# Altium project ADS1256.PrjPcb
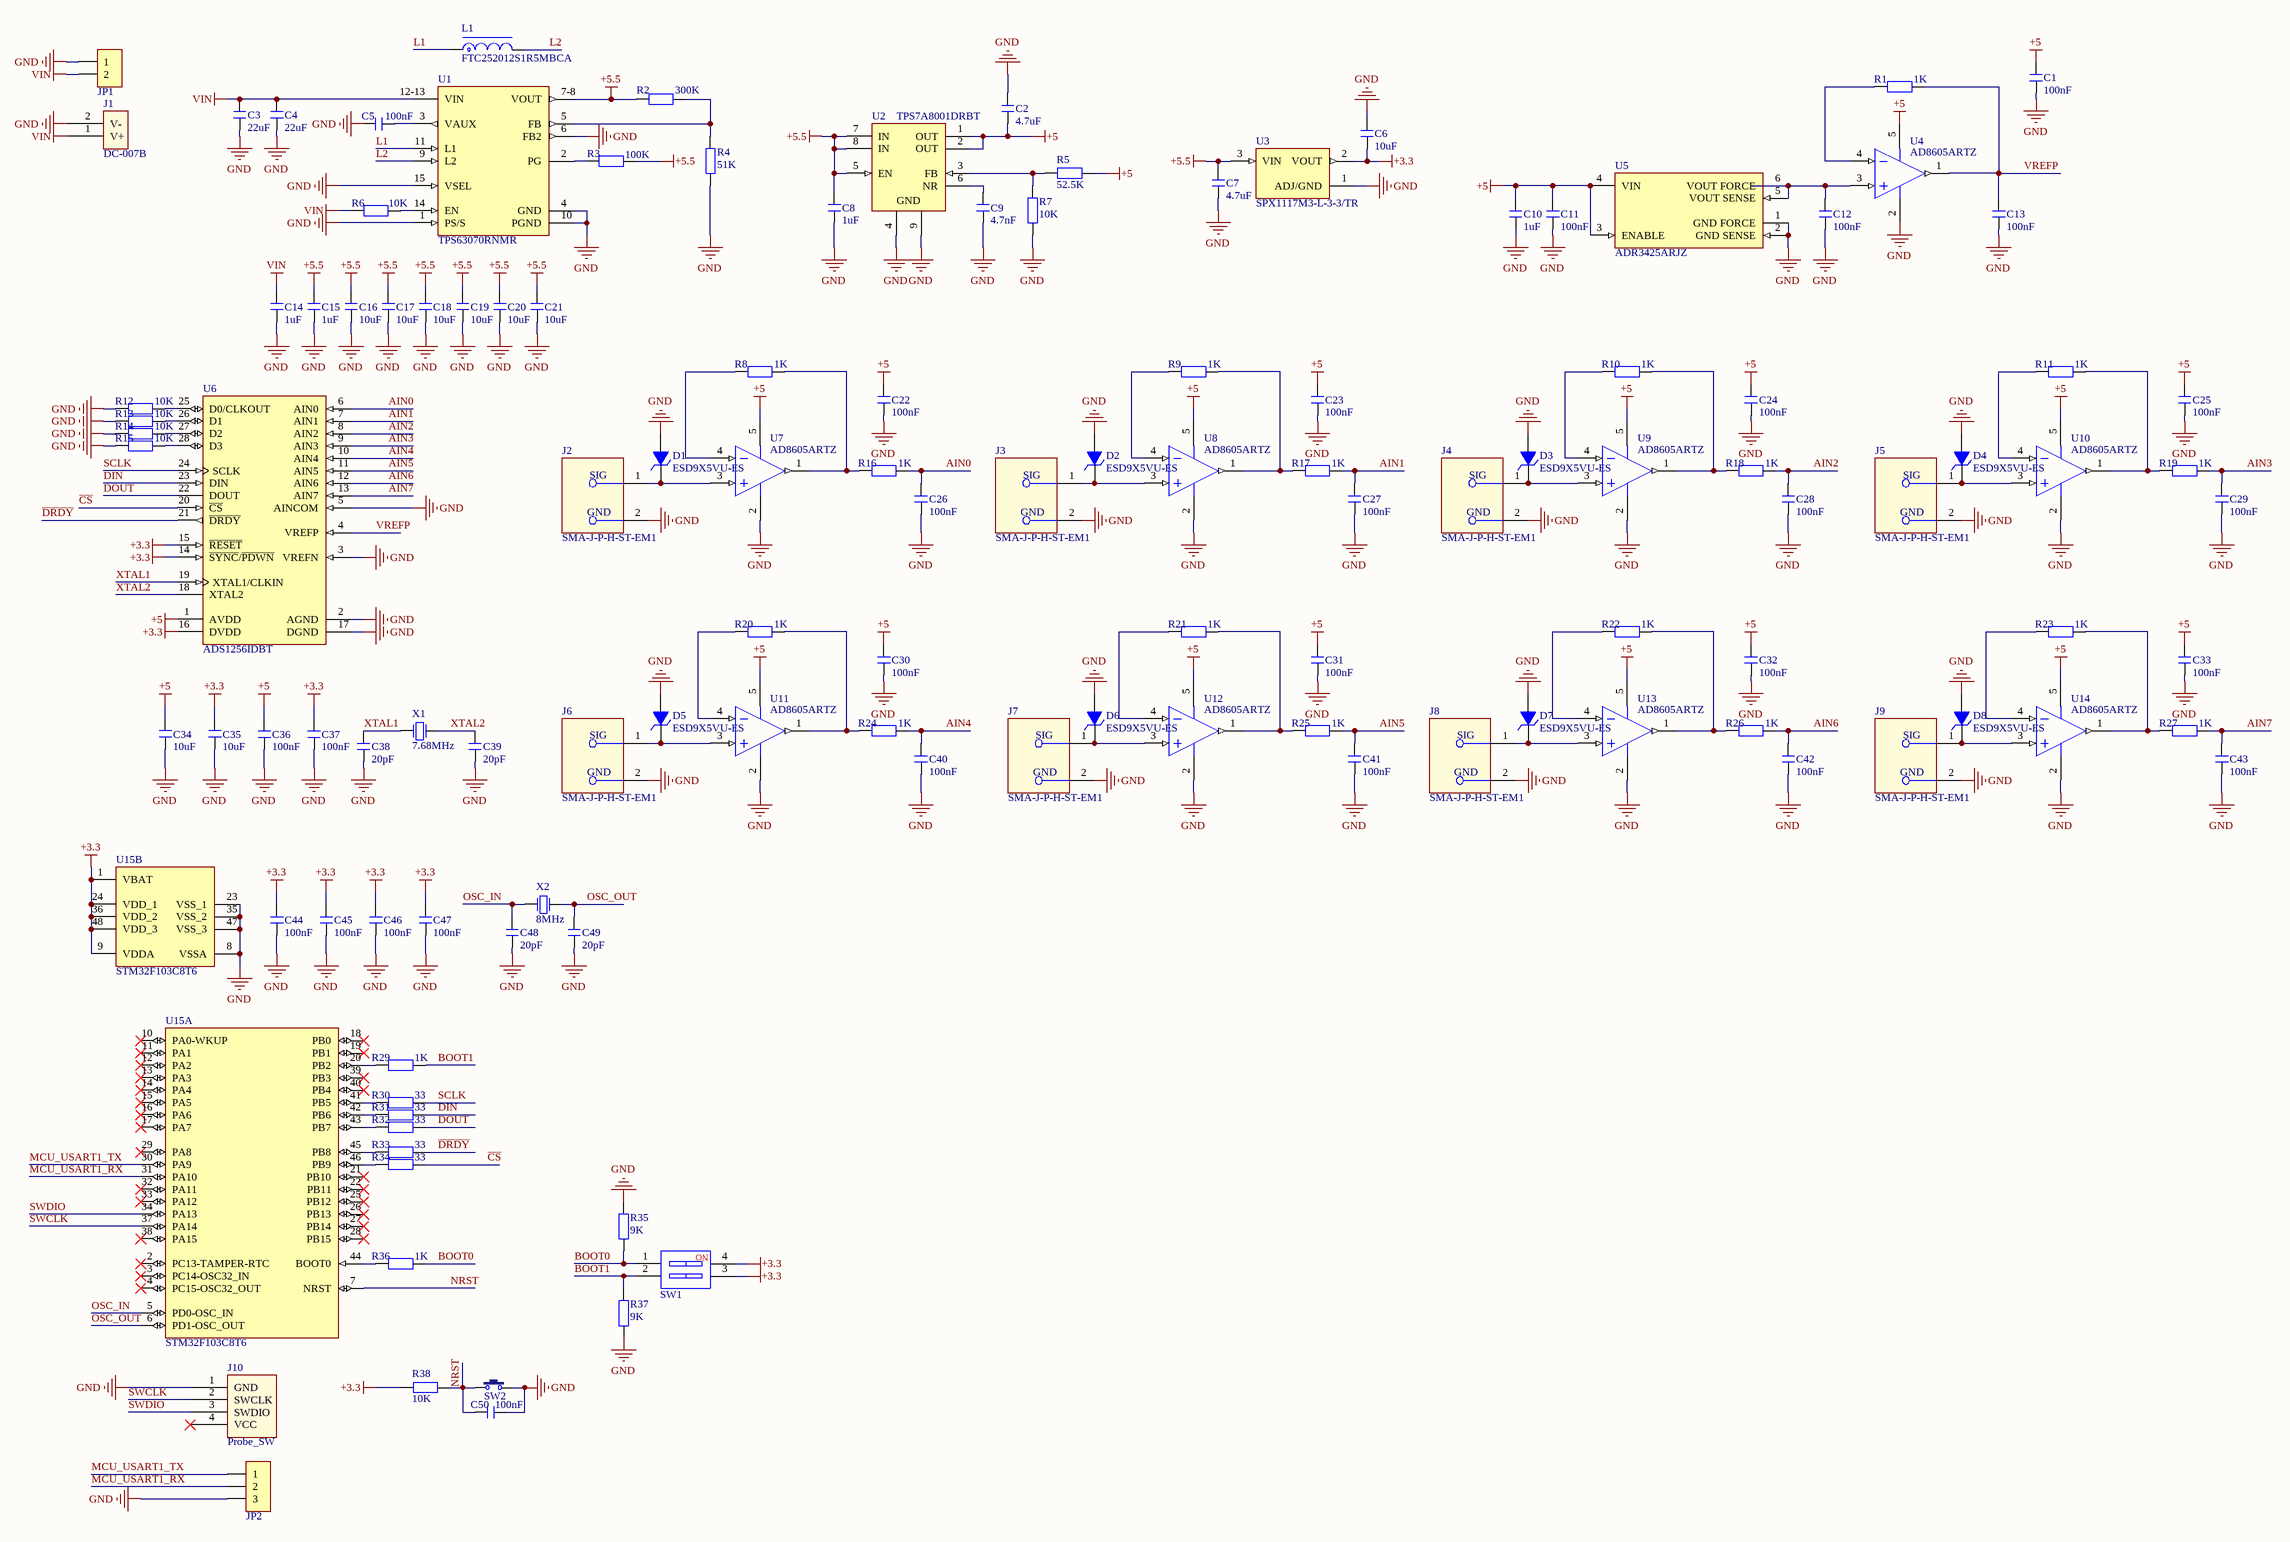
[diagram p0: ADS1256.SchDoc]
1 sheet, 127 parts. Net scope: global (net labels, ports and power ports of the same name join across sheets).
Board file: ADS1256.PcbDoc

## Sheet ADS1256.SchDoc
size A2; SheetNumber: 1; SheetTotal: 1

### Parts
C1  100nF  [C 0402_L]
C2  4.7uF  [C 0603_L]
C3  22uF  [C 1206_L]
C4  22uF  [C 1206_L]
C5  100nF  [C 0402_L]
C6  10uF  [C 0805_L]
C7  4.7uF  [C 0603_L]
C8  1uF  [C 0402_L]
C9  4.7nF  [C 0402_L]
C10  1uF  [C 0603_L]
C11  100nF  [C 0402_L]
C12  100nF  [C 0402_L]
C13  100nF  [C 0402_L]
C14  1uF  [C 0402_L]
C15  1uF  [C 0402_L]
C16  10uF  [C 0805_L]
C17  10uF  [C 0805_L]
C18  10uF  [C 0805_L]
C19  10uF  [C 0805_L]
C20  10uF  [C 0805_L]
C21  10uF  [C 0805_L]
C22  100nF  [C 0402_L]
C23  100nF  [C 0402_L]
C24  100nF  [C 0402_L]
C25  100nF  [C 0402_L]
C26  100nF  [C 0402_L]
C27  100nF  [C 0402_L]
C28  100nF  [C 0402_L]
C29  100nF  [C 0402_L]
C30  100nF  [C 0402_L]
C31  100nF  [C 0402_L]
C32  100nF  [C 0402_L]
C33  100nF  [C 0402_L]
C34  10uF  [C 0805_L]
C35  10uF  [C 0805_L]
C36  100nF  [C 0402_L]
C37  100nF  [C 0402_L]
C38  20pF  [C 0402_L]
C39  20pF  [C 0402_L]
C40  100nF  [C 0402_L]
C41  100nF  [C 0402_L]
C42  100nF  [C 0402_L]
C43  100nF  [C 0402_L]
C44  100nF  [C 0402_L]
C45  100nF  [C 0402_L]
C46  100nF  [C 0402_L]
C47  100nF  [C 0402_L]
C48  20pF  [C 0402_L]
C49  20pF  [C 0402_L]
C50  100nF  [C 0402_L]
D1  ESD9X5VU-ES  [DFN1006-2]
D2  ESD9X5VU-ES  [DFN1006-2]
D3  ESD9X5VU-ES  [DFN1006-2]
D4  ESD9X5VU-ES  [DFN1006-2]
D5  ESD9X5VU-ES  [DFN1006-2]
D6  ESD9X5VU-ES  [DFN1006-2]
D7  ESD9X5VU-ES  [DFN1006-2]
D8  ESD9X5VU-ES  [DFN1006-2]
J1  DC-007B  [DC-007B]
J2  SMA-J-P-H-ST-EM1  [FP-SMA-J-P-H-ST-EM1-MFG]
J3  SMA-J-P-H-ST-EM1  [FP-SMA-J-P-H-ST-EM1-MFG]
J4  SMA-J-P-H-ST-EM1  [FP-SMA-J-P-H-ST-EM1-MFG]
J5  SMA-J-P-H-ST-EM1  [FP-SMA-J-P-H-ST-EM1-MFG]
J6  SMA-J-P-H-ST-EM1  [FP-SMA-J-P-H-ST-EM1-MFG]
J7  SMA-J-P-H-ST-EM1  [FP-SMA-J-P-H-ST-EM1-MFG]
J8  SMA-J-P-H-ST-EM1  [FP-SMA-J-P-H-ST-EM1-MFG]
J9  SMA-J-P-H-ST-EM1  [FP-SMA-J-P-H-ST-EM1-MFG]
J10  Probe_SW  [Probe_SW]
JP1  HDR-1X2  [KF2510-LI-2P]  (value not drawn)
JP2  HDR-1X3  [HDR2.54-LI-3P]  (value not drawn)
L1  FTC252012S1R5MBCA  [NR2520]
R1  1K  [R 0402_L]
R2  300K  [R 0402_L]
R3  100K  [R 0402_L]
R4  51K  [R 0402_L]
R5  52.5K  [R 0402_L]
R6  10K  [R 0402_L]
R7  10K  [R 0402_L]
R8  1K  [R 0402_L]
R9  1K  [R 0402_L]
R10  1K  [R 0402_L]
R11  1K  [R 0402_L]
R12  10K  [R 0402_L]
R13  10K  [R 0402_L]
R14  10K  [R 0402_L]
R15  10K  [R 0402_L]
R16  1K  [R 0402_L]
R17  1K  [R 0402_L]
R18  1K  [R 0402_L]
R19  1K  [R 0402_L]
R20  1K  [R 0402_L]
R21  1K  [R 0402_L]
R22  1K  [R 0402_L]
R23  1K  [R 0402_L]
R24  1K  [R 0402_L]
R25  1K  [R 0402_L]
R26  1K  [R 0402_L]
R27  1K  [R 0402_L]
R29  1K  [R 0402_L]
R30  33  [R 0402_L]
R31  33  [R 0402_L]
R32  33  [R 0402_L]
R33  33  [R 0402_L]
R34  33  [R 0402_L]
R35  9K  [R 0402_L]
R36  1K  [R 0402_L]
R37  9K  [R 0402_L]
R38  10K  [R 0402_L]
SW1  SW-2P  [CSW1.27 SMD-2P]  (value not drawn)
SW2  3x6x5  [TSW SMD-3*6*2.5]  (value not drawn)
U1  TPS63070RNMR  [FP-RNM0015A-MFG]
U2  TPS7A8001DRBT  [DRB0008A_V]
U3  SPX1117M3-L-3-3/TR  [SOT230P700X180-3N]
U4  AD8605ARTZ  [SOT23-5]
U5  ADR3425ARJZ  [SOT23-6L]
U6  ADS1256IDBT  [SSOP28]
U7  AD8605ARTZ  [SOT23-5]
U8  AD8605ARTZ  [SOT23-5]
U9  AD8605ARTZ  [SOT23-5]
U10  AD8605ARTZ  [SOT23-5]
U11  AD8605ARTZ  [SOT23-5]
U12  AD8605ARTZ  [SOT23-5]
U13  AD8605ARTZ  [SOT23-5]
U14  AD8605ARTZ  [SOT23-5]
U15  STM32F103C8T6  [STM-LQFP48_L]  (parts A,B of 2)
X1  7.68MHz  [OSC HC-49SMD]
X2  8MHz  [OSC 5032-2P]

### Nets
+3.3: C6.1 C35.1 C37.2 C44.2 C45.2 C46.2 C47.2 R38.2 SW1.3 SW1.4 U3.2(VOUT) U6.14(~{SYNC}/~{PDWN}) U6.15(~{RESET}) U6.16(DVDD) U15.1(VBAT) U15.9(VDDA) U15.24(VDD_1) U15.36(VDD_2) U15.48(VDD_3)
+5: C1.2 C2.1 C10.2 C11.2 C22.2 C23.2 C24.2 C25.2 C30.2 C31.2 C32.2 C33.2 C34.1 C36.2 R5.1 U2.1(OUT) U2.2(OUT) U4.5(+V) U5.3(ENABLE) U5.4(VIN) U6.1(AVDD) U7.5(+V) U8.5(+V) U9.5(+V) U10.5(+V) U11.5(+V) U12.5(+V) U13.5(+V) U14.5(+V)
+5.5: C7.2 C8.2 C15.1 C16.1 C17.1 C18.1 C19.1 C20.1 C21.1 R2.2 R3.1 U1.7-8(VOUT) U2.5(EN) U2.7(IN) U2.8(IN) U3.3(VIN)
GND: C1.1 C2.2 C3.1 C4.1 C5.2 C6.2 C7.1 C8.1 C9.1 C10.1 C11.1 C12.1 C13.1 C14.2 C15.2 C16.2 C17.2 C18.2 C19.2 C20.2 C21.2 C22.1 C23.1 C24.1 C25.1 C26.1 C27.1 C28.1 C29.1 C30.1 C31.1 C32.1 C33.1 C34.2 C35.2 C36.1 C37.1 C38.1 C39.1 C40.1 C41.1 C42.1 C43.1 C44.1 C45.1 C46.1 C47.1 C48.1 C49.1 C50.2 D1.2(A) D2.2(A) D3.2(A) D4.2(A) D5.2(A) D6.2(A) D7.2(A) D8.2(A) J1.2(V-) J2.2(MNT_1) J3.2(MNT_1) J4.2(MNT_1) J5.2(MNT_1) J6.2(MNT_1) J7.2(MNT_1) J8.2(MNT_1) J9.2(MNT_1) J10.1(GND) JP1.1 JP2.3 R4.1 R7.1 R12.2 R13.2 R14.2 R15.2 R35.2 R37.1 SW2.2 U1.1(PS/S) U1.4(GND) U1.6(FB2) U1.10(PGND) U1.15(VSEL) U2.4(GND) U2.9(GND) U3.1(ADJ/GND) U4.2(-V) U5.1(GND_FORCE) U5.2(GND_SENSE) U6.2(AGND) U6.3(VREFN) U6.5(AINCOM) U6.17(DGND) U7.2(-V) U8.2(-V) U9.2(-V) U10.2(-V) U11.2(-V) U12.2(-V) U13.2(-V) U14.2(-V) U15.8(VSSA) U15.23(VSS_1) U15.35(VSS_2) U15.47(VSS_3)
VIN: C3.2 C4.2 C14.1 J1.1(V+) JP1.2 R6.1 U1.12-13(VIN)
AIN0: C26.2 R16.2 U6.6(AIN0)
AIN1: C27.2 R17.2 U6.7(AIN1)
AIN2: C28.2 R18.2 U6.8(AIN2)
AIN3: C29.2 R19.2 U6.9(AIN3)
AIN4: C40.2 R24.2 U6.10(AIN4)
AIN5: C41.2 R25.2 U6.11(AIN5)
AIN6: C42.2 R26.2 U6.12(AIN6)
AIN7: C43.2 R27.2 U6.13(AIN7)
BOOT0: R35.1 R36.2 SW1.1
BOOT1: R29.2 R37.2 SW1.2
~{CS}: R34.2 U6.20(~{CS})
~{DRDY}: R33.2 U6.21(~{DRDY})
DIN: R31.2 U6.23(DIN)
DOUT: R32.2 U6.22(DOUT)
L1: L1.1 U1.11(L1)
L2: L1.2 U1.9(L2)
MCU_USART1_RX: JP2.2 U15.31(PA10)
MCU_USART1_TX: JP2.1 U15.30(PA9)
NRST: C50.1 R38.1 SW2.1 U15.7(NRST)
OSC_IN: C48.2 U15.5(PD0-OSC_IN) X2.1
OSC_OUT: C49.2 U15.6(PD1-OSC_OUT) X2.2
SCLK: R30.2 U6.24(SCLK)
SWCLK: J10.2(SWCLK) U15.37(PA14)
SWDIO: J10.3(SWDIO) U15.34(PA13)
VREFP: C13.2 R1.2 U4.1(OUT) U6.4(VREFP)
XTAL1: C38.2 U6.19(XTAL1/CLKIN) X1.1
XTAL2: C39.2 U6.18(XTAL2) X1.2
NetC5_1: C5.1 U1.3(VAUX)
NetC9_2: C9.2 U2.6(NR)
NetC12_2: C12.2 U4.3(+IN) U5.5(VOUT_SENSE) U5.6(VOUT_FORCE)
NetD1_1: D1.1(K) J2.1 U7.3(+IN)
NetD2_1: D2.1(K) J3.1 U8.3(+IN)
NetD3_1: D3.1(K) J4.1 U9.3(+IN)
NetD4_1: D4.1(K) J5.1 U10.3(+IN)
NetD5_1: D5.1(K) J6.1 U11.3(+IN)
NetD6_1: D6.1(K) J7.1 U12.3(+IN)
NetD7_1: D7.1(K) J8.1 U13.3(+IN)
NetD8_1: D8.1(K) J9.1 U14.3(+IN)
NetR1_1: R1.1 U4.4(-IN)
NetR2_1: R2.1 R4.2 U1.5(FB)
NetR3_2: R3.2 U1.2(PG)
NetR5_2: R5.2 R7.2 U2.3(FB)
NetR6_2: R6.2 U1.14(EN)
NetR8_1: R8.1 U7.4(-IN)
NetR8_2: R8.2 R16.1 U7.1(OUT)
NetR9_1: R9.1 U8.4(-IN)
NetR9_2: R9.2 R17.1 U8.1(OUT)
NetR10_1: R10.1 U9.4(-IN)
NetR10_2: R10.2 R18.1 U9.1(OUT)
NetR11_1: R11.1 U10.4(-IN)
NetR11_2: R11.2 R19.1 U10.1(OUT)
NetR12_1: R12.1 U6.25(D0/CLKOUT)
NetR13_1: R13.1 U6.26(D1)
NetR14_1: R14.1 U6.27(D2)
NetR15_1: R15.1 U6.28(D3)
NetR20_1: R20.1 U11.4(-IN)
NetR20_2: R20.2 R24.1 U11.1(OUT)
NetR21_1: R21.1 U12.4(-IN)
NetR21_2: R21.2 R25.1 U12.1(OUT)
NetR22_1: R22.1 U13.4(-IN)
NetR22_2: R22.2 R26.1 U13.1(OUT)
NetR23_1: R23.1 U14.4(-IN)
NetR23_2: R23.2 R27.1 U14.1(OUT)
NetR29_1: R29.1 U15.20(PB2)
NetR30_1: R30.1 U15.41(PB5)
NetR31_1: R31.1 U15.42(PB6)
NetR32_1: R32.1 U15.43(PB7)
NetR33_1: R33.1 U15.45(PB8)
NetR34_1: R34.1 U15.46(PB9)
NetR36_1: R36.1 U15.44(BOOT0)

Not connected (* = marked no-connect by the designer): J10 4(VCC)*; U15 2(PC13-TAMPER-RTC)* 3(PC14-OSC32_IN)* 4(PC15-OSC32_OUT)* 10(PA0-WKUP)* 11(PA1)* 12(PA2)* 13(PA3)* 14(PA4)* 15(PA5)* 16(PA6)* 17(PA7)* 18(PB0)* 19(PB1)* 21(PB10)* 22(PB11)* 25(PB12)* 26(PB13)* 27(PB14)* 28(PB15)* 29(PA8)* 32(PA11)* 33(PA12)* 38(PA15)* 39(PB3)* 40(PB4)*

### Notes on the sheet
- (in symbol CMP-02754-000006-1) SIG; GND
- (in symbol SW-2P) NO

### Library data of the parts
C1-C50 = C: 贴片电容; 淘宝ID: 小糖豆的小窝窝; BOM名称: 贴片电容; 下单链接: https://item.taobao.com/item.htm?ft=t&id=613637044352
D1-D8 = ESD: ESD保护
J2-J9 = CMP-02754-000006-1: CONN SMA JACK STR 50OHM EDGE MNT; Center Contact Plating: Gold; Voltage Rating: 335V; Impedance: 50R; Max Frequency: 6GHz; Body Material: Brass; Dielectric Material: PTFE; Connector Type: SMA; Series: SMA; Fastening Type: Threaded; Depth: 13.33mm; Max Operating Temperature: 125°C; Termination: Solder; Length: 6.35mm; Radiation Hardening: No; RoHS Compliant: Yes; Insulation Material: Polytetrafluoroethylene; Min Operating Temperature: -65°C; Packaging: Tray; Housing Color: Gold; Body Plating: Gold; Mount: Edge; Contact Material: Copper; Orientation: Straight; Package Quantity: 1; Contact Plating: Gold; Case/Package: SMA
JP1 = Header 2: 2P接插件; 淘宝ID: 小糖豆的小窝窝; BOM名称: 2P接插件; 下单链接: https://item.taobao.com/item.htm?ft=t&id=613637044352
JP2 = Header 3: 3P接插件; 淘宝ID: 小糖豆的小窝窝; BOM名称: 3P接插件; 下单链接: https://item.taobao.com/item.htm?ft=t&id=613637044352
L1 = L-CDRH: 功率屏蔽电感; 淘宝ID: 小糖豆的小窝窝; BOM名称: 功率屏蔽电感; 下单链接: https://item.taobao.com/item.htm?ft=t&id=613637044352
R1-R27 R29-R38 = R: 贴片电阻; 淘宝ID: 小糖豆的小窝窝; BOM名称: 贴片电阻; 下单链接: https://item.taobao.com/item.htm?ft=t&id=613637044352
SW1 = SW-2P: 2路编码开关; 淘宝ID: 小糖豆的小窝窝; BOM名称: 2路编码开关; 下单链接: https://item.taobao.com/item.htm?ft=t&id=613637044352
SW2 = TSW 3x6: 3x6轻触开关; 淘宝ID: 小糖豆的小窝窝; BOM名称: 3x6轻触开关; 下单链接: https://item.taobao.com/item.htm?ft=t&id=613637044352
U1 = CMP-04918-000409-1: IC REG BCK BST ADJ 3.6A 15VQFN; Min Output Voltage: 2.5V; Output Configuration: Positive; Min Input Voltage: 2V; Switching Frequency: 2.4MHz; Topology: Buck-Boost; Number of Outputs: 1; Max Output Voltage: 9V; Output Current: 2A; Synchronous Rectifier: Yes; Output Type: Adjustable; Max Input Voltage: 16V; Quiescent Current: 50uA; Max Operating Temperature: 125°C; Case/Package: VQFN; Min Operating Temperature: -40°C; Packaging: Tape and Reel; RoHS Compliant: Yes; Number of Pins: 15; Mount: Surface Mount; Lead Free: Lead Free
U2 = CMP-0395-00597-2: Single Output LDO, 1 A, Adjustable 0.8 to 6 V Output, 2.2 to 6.5 V Input, with High-Bandwidth PSRR, 8-pin SON (DRB), -40 to 125 degC, Green (RoHS & no Sb/Br); Manufacturer: Texas Instruments; Vin(Min)(V): 2.2; Iq(Typ)(mA): 0.04; Vout Adj(Max)(V): 6; SubFamily: Single Channel LDO; Accuracy(%): 3; Vin(Max)(V): 6.5; Vdo(Typ)(mV): 170; Vout Adj(Min)(V): 0.8; Iout(Max)(A): 1; PackageReference: DRB0008A; ComponentLink3URL: http://www.ti.com/litv/pdf/mpds118h; Eco-Plan: Green (RoHS & no Sb/Br); ComponentLink2Description: Datasheet; PackageVersion: 4203482-2/K; PackageDescription: 8-Pin Plastic Small Outline, Body 3 x 3 mm, Pitch 0.65 mm; ComponentLink2URL: http://www.ti.com/general/docs/lit/getliterature.tsp?genericPartNumber=TPS7A8001&fileType=pdf; ComponentLink1Description: Manufacturer URL; DatasheetVersion: SBVS135G; ComponentLink1URL: http://www.ti.com/; Mounting Technology: Surface Mount; PartNumber: TPS7A8001DRBT; ComponentLink3Description: Package Specification
U3 = SPX1117M3-L-3-3/TR: Linear Voltage Regulator IC Positive Fixed 1 Output 800mA SOT-223; MF: MaxLinear, Inc.; Value: *; SnapEDA_Link: https://www.snapeda.com/parts/SPX1117M3-L-3-3/TR/MaxLinear%2C%20Inc./view-part/376705/?ref=snap; Package: SOT-223 Exar; MP: SPX1117M3-L-3-3/TR; Price: None; Availability: Unavailable
U4 U7-U14 = AD8605ARTZ: Precision Low Noise CMOS Rail-to-Rail Input/Output Operational Amplifiers
U5 = ADR3425ARJZ: Micropower, High Accuracy / Voltage References, 2.5V; Reference Type: Series; Temperature Coefficient: 8ppm/°C; Supply Current: 85uA; Output Current: 10mA; Min Input Voltage: 2.7V; Number of Channels: 1; Tolerance: 0.1%; Max Input Voltage: 6V; Quiescent Current: 100uA; Output Type: Fixed; Output Voltage: 2.5V; RoHS Compliant: Yes; Min Operating Temperature: -40°C; Reference Voltage: 2.5V; Series: -; Max Output Current: 10mA; Number of Pins: 6; Packaging: Tape and Reel; Nominal Supply Current: 85uA; Package Quantity: 1; Operating Supply Current: 85uA; Max Output Voltage: 2.5V; Lead Free: Contains Lead; Min Output Voltage: 2.5V; Max Operating Temperature: 125°C; REACH SVHC: No SVHC; Case/Package: SOT; Radiation Hardening: No
U6 = ADS1256IDBT: 24-Bit, 30 kSPS Very Low Noise Delta-Sigma ADC with Multiplexer, -40 to 85 degC, 28-pin SOP (DB28), Green (RoHS & no Sb/Br); Manufacturer: Texas Instruments; Digital Supply(Max)(V): 3.6; Analog Voltage AV/DD(Max)(V): 5.25; # Input Channels: 8; Analog Voltage AV/DD(Min)(V): 4.75; Interface: Serial SPI; SubFamily: Precision ADC (<=10MSPS); Digital Supply(Min)(V): 1.8; Sample Rate (max)(SPS): 30k; Resolution(Bits): 24; PackageReference: DB28; ComponentLink1Description: Manufacturer URL; ComponentLink2Description: Datasheet; ComponentLink1URL: http://www.ti.com/; PackageVersion: 4040065/E, 12/2001; PackageDescription: 28-Pin Plastic Small Outline, Body 10.2 X 5.3 mm, Pitch 0.65 mm; PartNumber: ADS1256IDBT; DatasheetVersion: SBAS288J; Architecture: Delta-Sigma; Code_JEDEC: MO-150; ComponentLink2URL: http://www.ti.com/general/docs/lit/getliterature.tsp?genericPartNumber=ADS1256&fileType=pdf; ComponentLink3URL: http://www.ti.com/lit/ml/msso002e/msso002e.pdf; ComponentLink3Description: Package Specification; Mounting Technology: Surface Mount; Eco-Plan: Green (RoHS & no Sb/Br)
U15 = CMP-0237-00215-3: ARM Cortex-M3 32-bit MCU, 64 KB Flash, 20 KB Internal RAM, 37 I/Os, 48-pin LQFP, -40 to 85 degC, Tray; Supply Voltage(Vcc) min (V): 2; Internal RAM Size (kB): 20; FLASH Size (Prog) (kB): 64; A/D Converter: 2x12-bit (10 Channel); I/Os (High Current): 37; Operating Frequency(F) (Processor speed) (MHz): 72; Core: ARM Cortex-M3; ComponentLink3Description: Package Specification; Mounting Technology: Surface Mount; PartNumber: STM32F103C8T6; PackageReference: LQFP48; Packing: Tray; ComponentLink3URL: http://www.st.com/st-web-ui/static/active/en/resource/technical/document/datasheet/DM00058181.pdf; DatasheetVersion: Rev. 16; ComponentLink1URL: http://www.st.com/web/en/home.html; PackageVersion: Rev. 6, 06/2013; ComponentLink2URL: http://www.st.com/st-web-ui/static/active/en/resource/technical/document/datasheet/CD00161566.pdf; ComponentLink1Description: Manufacturer URL; ComponentLink2Description: Datasheet; PackageDescription: 48-Pin Low Profile Quad Flat Package, 7 x 7 mm Body, 0.5 mm Pitch
X1 X2 = XTAL-2P: 2脚无源脚晶振; 淘宝ID: 小糖豆的小窝窝; BOM名称: 2脚无源脚晶振; 下单链接: https://item.taobao.com/item.htm?ft=t&id=613637044352